# EAGLE schematic fc_shield (EAGLE 8.2.2)
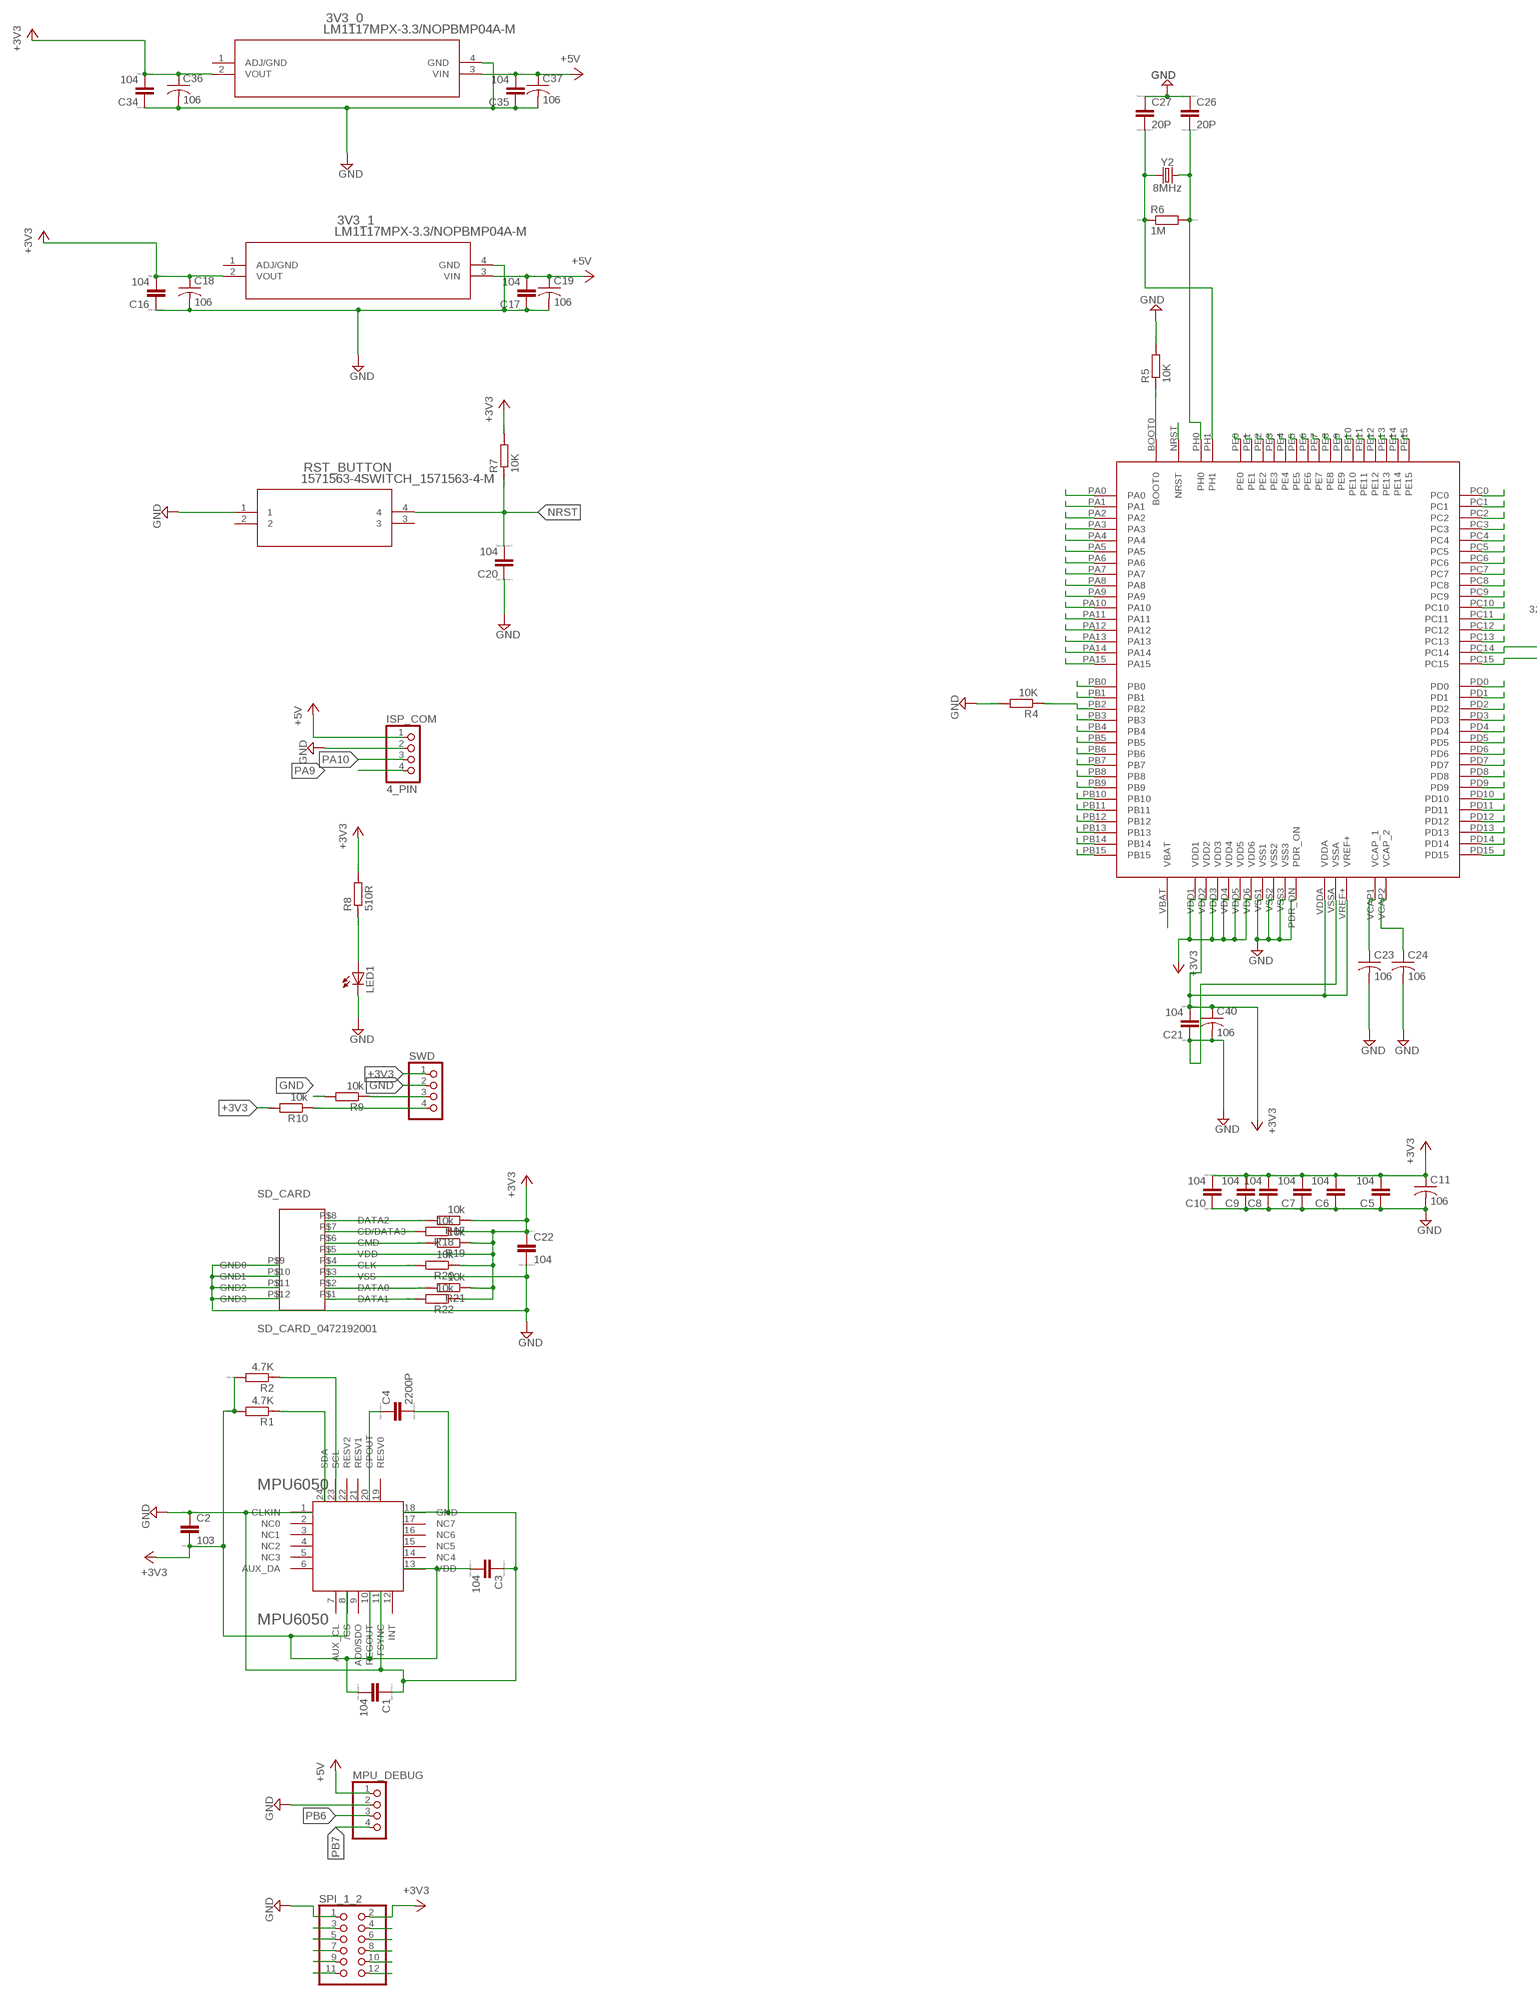
[diagram p0: schematic, sheet 1, part 1 of 2]
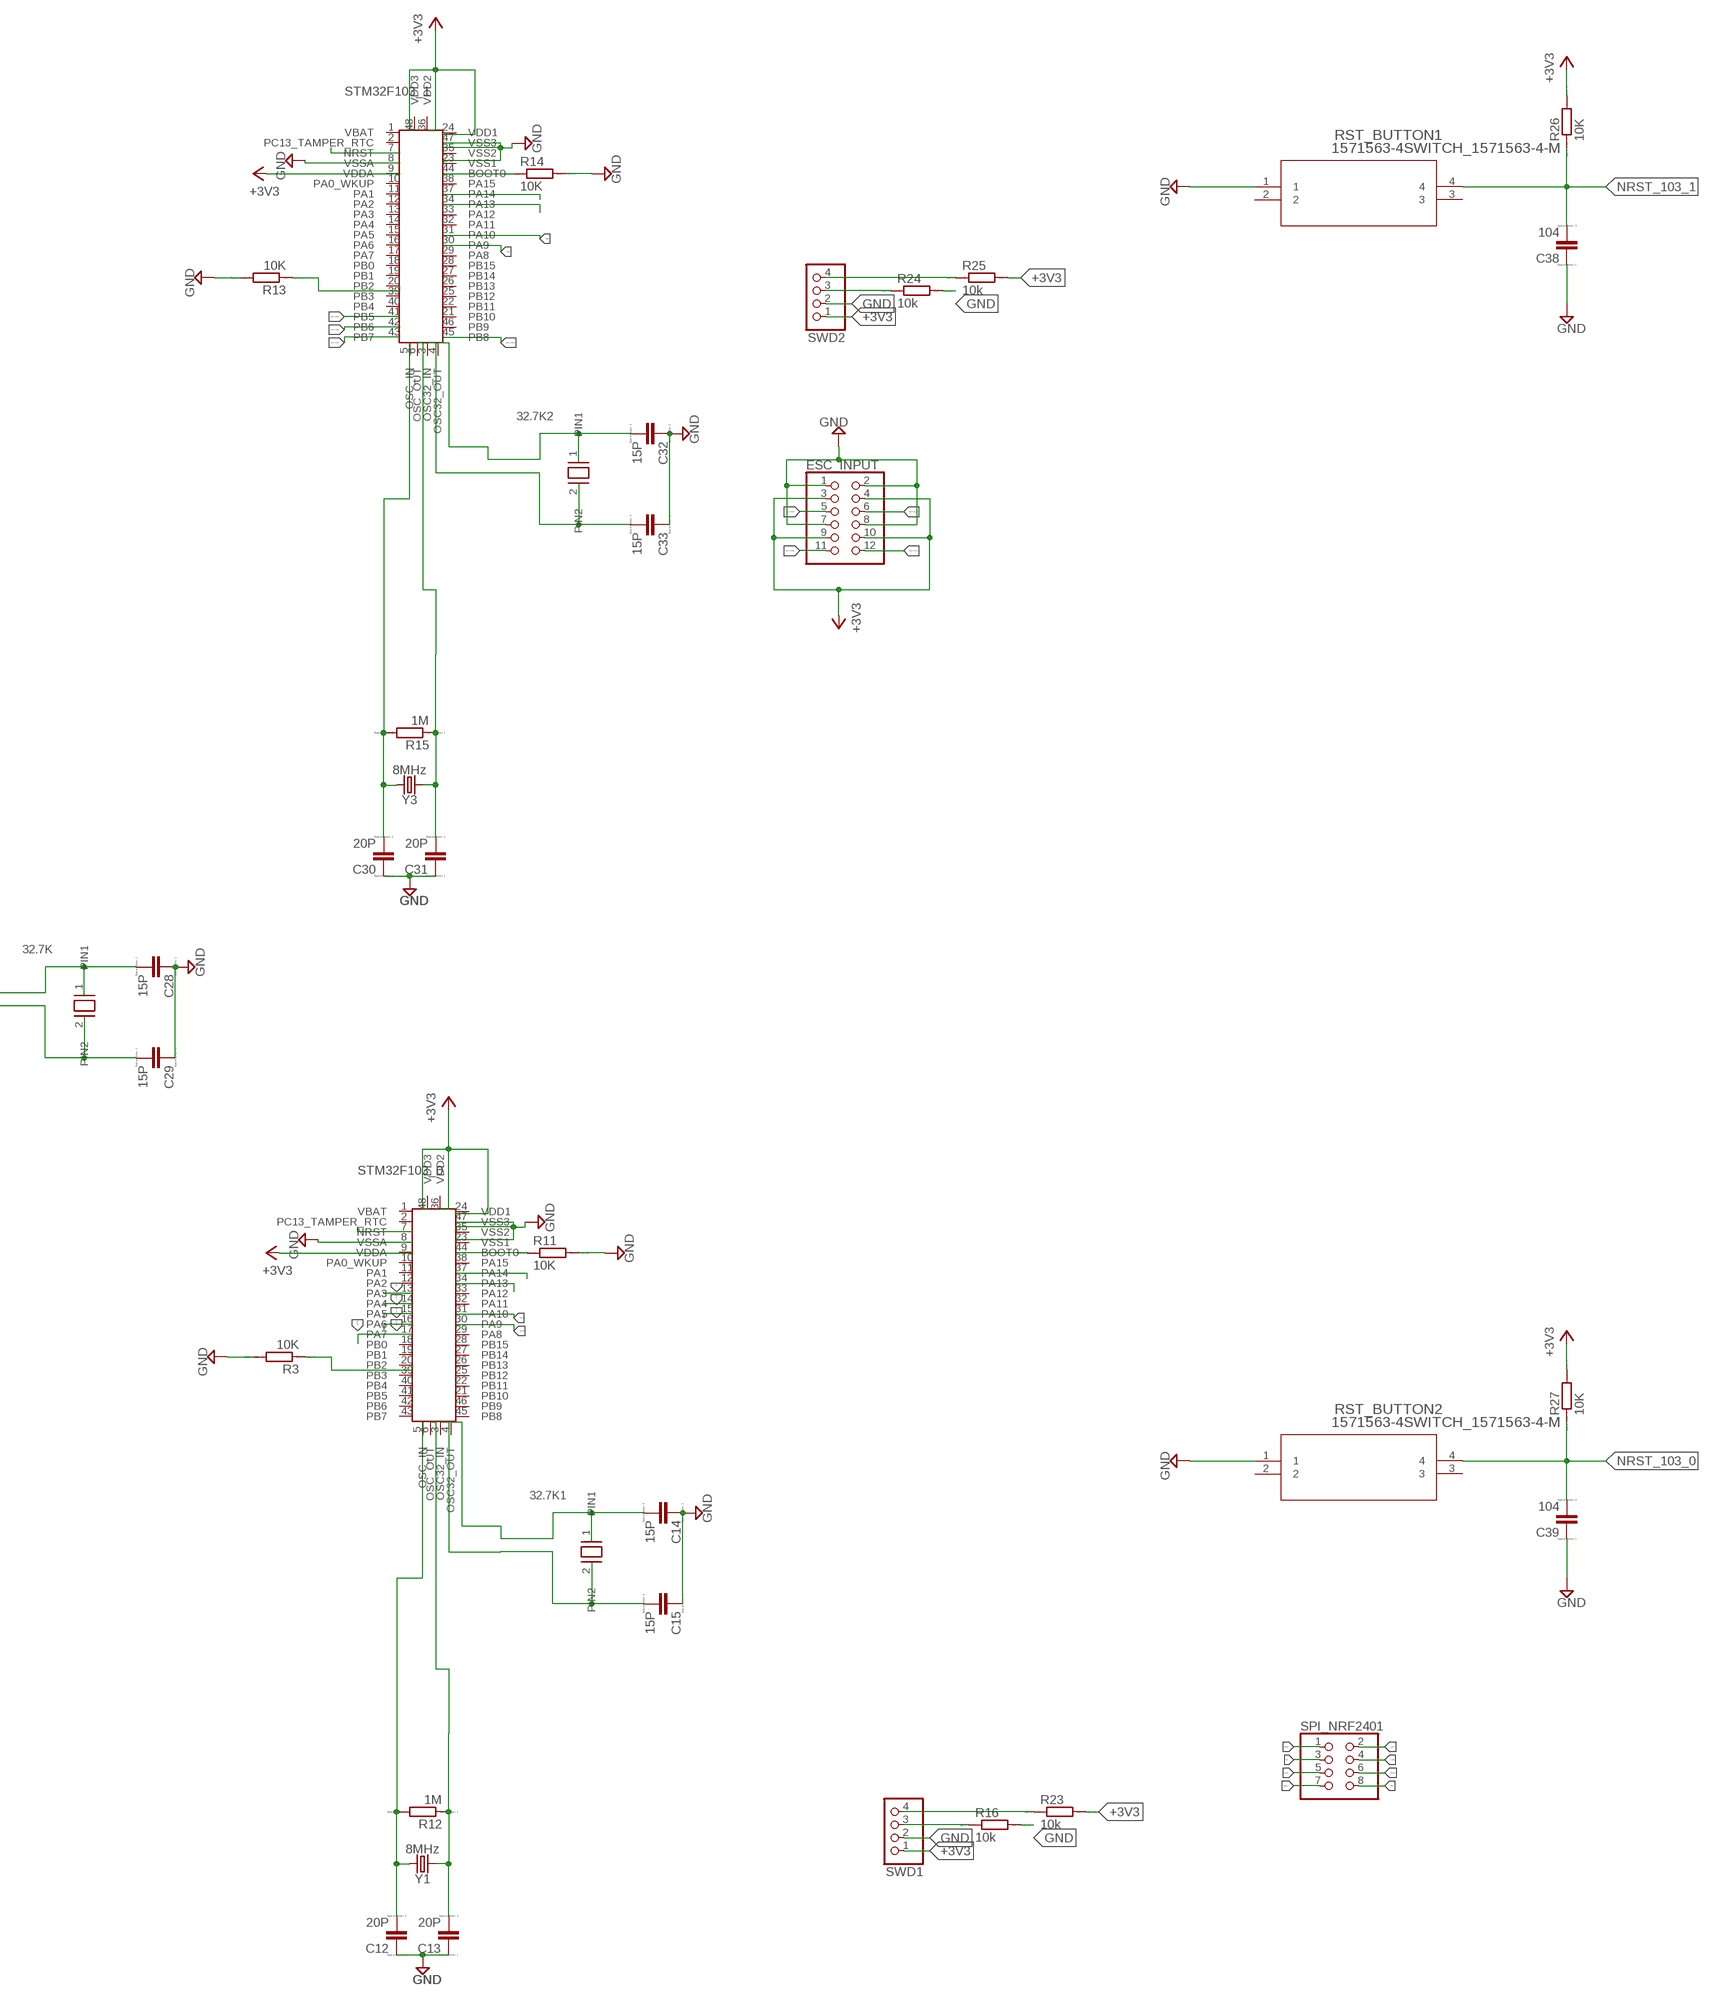
[diagram p1: schematic, sheet 1, part 2 of 2]

## Parts
3V3_0  LM1117MPX-3.3/NOPBMP04A-M  [MP04A-M]
3V3_1  LM1117MPX-3.3/NOPBMP04A-M  [MP04A-M]
32.7K  CM315D  [CM315D_32.7K]
32.7K1  CM315D  [CM315D_32.7K]
32.7K2  CM315D  [CM315D_32.7K]
C1  104  CC0603  [C0603]
C2  103  CC0603  [C0603]
C3  104  CC0603  [C0603]
C4  2200P  CC0603  [C0603]
C5  104  CC0603  [C0603]
C6  104  CC0603  [C0603]
C7  104  CC0603  [C0603]
C8  104  CC0603  [C0603]
C9  104  CC0603  [C0603]
C10  104  CC0603  [C0603]
C11  106  C-USC0805  [C0805]
C12  20P  CC0603  [C0603]
C13  20P  CC0603  [C0603]
C14  15P  CC0603  [C0603]
C15  15P  CC0603  [C0603]
C16  104  CC0603  [C0603]
C17  104  CC0603  [C0603]
C18  106  C-USC0805  [C0805]
C19  106  C-USC0805  [C0805]
C20  104  CC0603  [C0603]
C21  104  CC0603  [C0603]
C22  104  CC0603  [C0603]
C23  106  C-USC0805  [C0805]
C24  106  C-USC0805  [C0805]
C26  20P  CC0603  [C0603]
C27  20P  CC0603  [C0603]
C28  15P  CC0603  [C0603]
C29  15P  CC0603  [C0603]
C30  20P  CC0603  [C0603]
C31  20P  CC0603  [C0603]
C32  15P  CC0603  [C0603]
C33  15P  CC0603  [C0603]
C34  104  CC0603  [C0603]
C35  104  CC0603  [C0603]
C36  106  C-USC0805  [C0805]
C37  106  C-USC0805  [C0805]
C38  104  CC0603  [C0603]
C39  104  CC0603  [C0603]
C40  106  C-USC0805  [C0805]
ESC_INPUT  PINHD-2X6/90  [2X06/90]
ISP_COM  4_PIN  PINHD-1X4  [1X04]
LED1  LEDCHIPLED_0805  [CHIPLED_0805]
MPU6050  MPU6050  [MPU6050]
MPU_DEBUG  PINHD-1X4  [1X04]
R1  4.7K  RR0603  [R0603]
R2  4.7K  RR0603  [R0603]
R3  10K  RR0603  [R0603]
R4  10K  RR0603  [R0603]
R5  10K  RR0603  [R0603]
R6  1M  RR0603  [R0603]
R7  10K  RR0603  [R0603]
R8  510R  RR0603  [R0603]
R9  10k  RR0603  [R0603]
R10  10k  RR0603  [R0603]
R11  10K  RR0603  [R0603]
R12  1M  RR0603  [R0603]
R13  10K  RR0603  [R0603]
R14  10K  RR0603  [R0603]
R15  1M  RR0603  [R0603]
R16  10k  RR0603  [R0603]
R17  10k  RR0603  [R0603]
R18  10k  RR0603  [R0603]
R19  10k  RR0603  [R0603]
R20  10k  RR0603  [R0603]
R21  10k  RR0603  [R0603]
R22  10k  RR0603  [R0603]
R23  10k  RR0603  [R0603]
R24  10k  RR0603  [R0603]
R25  10k  RR0603  [R0603]
R26  10K  RR0603  [R0603]
R27  10K  RR0603  [R0603]
RST_BUTTON  1571563-4SWITCH_1571563-4-M  [SWITCH_1571563-4-M]
RST_BUTTON1  1571563-4SWITCH_1571563-4-M  [SWITCH_1571563-4-M]
RST_BUTTON2  1571563-4SWITCH_1571563-4-M  [SWITCH_1571563-4-M]
SD_CARD  SD_CARD_0472192001  [0472192001]
SPI_1_2  PINHD-2X6/90  [2X06/90]
SPI_NRF2401  PINHD-2X4  [2X04]
STM32F103_0  STM32F103C8T6  [STM32103C8T6_LQFP48]
STM32F103_1  STM32F103C8T6  [STM32103C8T6_LQFP48]
SWD  PINHD-1X4  [1X04]
SWD1  PINHD-1X4  [1X04]
SWD2  PINHD-1X4  [1X04]
U$1  STM32F4V_100PIN_GENERIC  [LQFP100]
Y1  8MHz  CRYSTAL-8MHZSMD-HC49UP  [HC49UP]
Y2  8MHz  CRYSTAL-8MHZSMD-HC49UP  [HC49UP]
Y3  8MHz  CRYSTAL-8MHZSMD-HC49UP  [HC49UP]

## Nets
+3V3: 3V3_0.2(VOUT) 3V3_1.2(VOUT) C1.2 C2.2 C3.2 C5.2 C6.2 C7.2 C8.2 C9.2 C10.2 C11.1 C16.2 C18.1 C21.2 C22.1 C34.2 C36.1 C40.1 ESC_INPUT.3 ESC_INPUT.4 ESC_INPUT.9 ESC_INPUT.10 MPU6050.8(/CS) MPU6050.10(REGOUT) MPU6050.13(VDD) R1.2 R2.2 R7.2 R8.2 R10.2 R17.1 R18.1 R19.1 R20.1 R21.1 R22.1 R23.2 R25.2 R26.2 R27.2 SD_CARD.P$5(VDD) SPI_1_2.2 SPI_NRF2401.2 STM32F103_0.9(VDDA) STM32F103_0.24(VDD1) STM32F103_0.36(VDD2) STM32F103_0.48(VDD3) STM32F103_1.9(VDDA) STM32F103_1.24(VDD1) STM32F103_1.36(VDD2) STM32F103_1.48(VDD3) SWD1.1 SWD2.1 SWD.1 U$1.VDD1 U$1.VDD2 U$1.VDD3 U$1.VDD4 U$1.VDD5 U$1.VDD6 U$1.VDDA U$1.VREF+
+5V: 3V3_0.3(VIN) 3V3_1.3(VIN) C17.2 C19.1 C35.2 C37.1 ISP_COM.1 MPU_DEBUG.1
BOOT0: R5.1 U$1.BOOT0
CE: SPI_NRF2401.3 STM32F103_0.13(PA3)
CSN: SPI_NRF2401.4 STM32F103_0.14(PA4)
GND: 3V3_0.4(GND) 3V3_1.4(GND) C1.1 C2.1 C3.1 C4.2 C5.1 C6.1 C7.1 C8.1 C9.1 C10.1 C11.2 C12.1 C13.1 C14.1 C15.1 C16.1 C17.1 C18.2 C19.2 C20.1 C21.1 C22.2 C23.2 C24.2 C26.1 C27.1 C28.1 C29.1 C30.1 C31.1 C32.1 C33.1 C34.1 C35.1 C36.2 C37.2 C38.1 C39.1 C40.2 ESC_INPUT.1 ESC_INPUT.2 ESC_INPUT.7 ESC_INPUT.8 ISP_COM.2 LED1.C MPU6050.1(CLKIN) MPU6050.11(FSYNC) MPU6050.18(GND) MPU_DEBUG.2 R3.2 R4.2 R5.2 R9.2 R11.2 R13.2 R14.2 R16.2 R24.2 RST_BUTTON1.1 RST_BUTTON2.1 RST_BUTTON.1 SD_CARD.P$3(VSS) SD_CARD.P$9(GND0) SD_CARD.P$10(GND1) SD_CARD.P$11(GND2) SD_CARD.P$12(GND3) SPI_1_2.1 SPI_NRF2401.1 STM32F103_0.8(VSSA) STM32F103_0.23(VSS1) STM32F103_0.35(VSS2) STM32F103_0.47(VSS3) STM32F103_1.8(VSSA) STM32F103_1.23(VSS1) STM32F103_1.35(VSS2) STM32F103_1.47(VSS3) SWD1.2 SWD2.2 SWD.2 U$1.PDR_ON U$1.VSS1 U$1.VSS2 U$1.VSS3 U$1.VSSA
IRQ: SPI_NRF2401.8
MISO: SPI_NRF2401.7 STM32F103_0.16(PA6)
MOSI: SPI_NRF2401.6 STM32F103_0.17(PA7)
MOTOR1: ESC_INPUT.5 STM32F103_1.41(PB5)
MOTOR2: ESC_INPUT.11 STM32F103_1.42(PB6)
MOTOR3: ESC_INPUT.6 STM32F103_1.43(PB7)
MOTOR4: ESC_INPUT.12 STM32F103_1.45(PB8)
N$1: LED1.A R8.1
N$2: R14.1 STM32F103_1.44(BOOT0)
N$3: C4.1 MPU6050.20(CPOUT)
N$4: R11.1 STM32F103_0.44(BOOT0)
N$5: R3.1 STM32F103_0.20(PB2)
N$6: R13.1 STM32F103_1.20(PB2)
NRST: C20.2 R7.1 RST_BUTTON.4 U$1.NRST
NRST_103_0: C39.2 R27.1 RST_BUTTON2.4 STM32F103_0.7(NRST)
NRST_103_1: C38.2 R26.1 RST_BUTTON1.4 STM32F103_1.7(NRST)
OSC32_IN_1: 32.7K2.2(PIN2) C33.2 STM32F103_1.3(OSC32_IN)
OSC32_IN_103: 32.7K1.2(PIN2) C15.2 STM32F103_0.3(OSC32_IN)
OSC32_OUT_1: 32.7K2.1(PIN1) C32.2 STM32F103_1.4(OSC32_OUT)
OSC32_OUT_103: 32.7K1.1(PIN1) C14.2 STM32F103_0.4(OSC32_OUT)
OSC_IN_1: C30.2 R15.2 STM32F103_1.5(OSC_IN) Y3.2
OSC_IN_103: C12.2 R12.2 STM32F103_0.5(OSC_IN) Y1.2
OSC_OUT_1: C31.2 R15.1 STM32F103_1.6(OSC_OUT) Y3.1
OSC_OUT_103: C13.2 R12.1 STM32F103_0.6(OSC_OUT) Y1.1
PA0: U$1.PA0
PA1: U$1.PA1
PA2: STM32F103_1.31(PA10) U$1.PA2
PA3: STM32F103_1.30(PA9) U$1.PA3
PA4: U$1.PA4
PA5: SPI_1_2.7 U$1.PA5
PA6: SPI_1_2.9 U$1.PA6
PA7: SPI_1_2.11 U$1.PA7
PA8: U$1.PA8
PA9: ISP_COM.4 STM32F103_0.31(PA10) U$1.PA9
PA10: ISP_COM.3 STM32F103_0.30(PA9) U$1.PA10
PA11: U$1.PA11
PA12: U$1.PA12
PA13: R10.1 SWD.4 U$1.PA13
PA14: R9.1 SWD.3 U$1.PA14
PA15: U$1.PA15
PB0: U$1.PB0
PB1: U$1.PB1
PB2: R4.1 U$1.PB2
PB3: U$1.PB3
PB4: U$1.PB4
PB5: U$1.PB5
PB6: MPU6050.23(SCL) MPU_DEBUG.3 R2.1 U$1.PB6
PB7: MPU6050.24(SDA) MPU_DEBUG.4 R1.1 U$1.PB7
PB8: U$1.PB8
PB9: U$1.PB9
PB10: SPI_1_2.8 U$1.PB10
PB11: U$1.PB11
PB12: U$1.PB12
PB13: U$1.PB13
PB14: U$1.PB14
PB15: U$1.PB15
PC0: U$1.PC0
PC1: U$1.PC1
PC2: SPI_1_2.10 U$1.PC2
PC3: SPI_1_2.12 U$1.PC3
PC4: SPI_1_2.3 U$1.PC4
PC5: SPI_1_2.5 U$1.PC5
PC6: U$1.PC6
PC7: U$1.PC7
PC8: R21.2 SD_CARD.P$2(DATA0) U$1.PC8
PC9: R22.2 SD_CARD.P$1(DATA1) U$1.PC9
PC10: R17.2 SD_CARD.P$8(DATA2) U$1.PC10
PC11: R18.2 SD_CARD.P$7(CD/DATA3) U$1.PC11
PC12: R20.2 SD_CARD.P$4(CLK) U$1.PC12
PC13: U$1.PC13
PC14: 32.7K.1(PIN1) C28.2 U$1.PC14
PC15: 32.7K.2(PIN2) C29.2 U$1.PC15
PD0: U$1.PD0
PD1: U$1.PD1
PD2: R19.2 SD_CARD.P$6(CMD) U$1.PD2
PD3: U$1.PD3
PD4: U$1.PD4
PD5: U$1.PD5
PD6: U$1.PD6
PD7: U$1.PD7
PD8: U$1.PD8
PD9: U$1.PD9
PD10: U$1.PD10
PD11: U$1.PD11
PD12: U$1.PD12
PD13: U$1.PD13
PD14: U$1.PD14
PD15: U$1.PD15
PE0: U$1.PE0
PE1: U$1.PE1
PE2: U$1.PE2
PE3: U$1.PE3
PE4: U$1.PE4
PE5: U$1.PE5
PE6: U$1.PE6
PE7: SPI_1_2.4 U$1.PE7
PE8: SPI_1_2.6 U$1.PE8
PE9: U$1.PE9
PE10: U$1.PE10
PE11: U$1.PE11
PE12: U$1.PE12
PE13: U$1.PE13
PE14: U$1.PE14
PE15: U$1.PE15
PH0: C26.2 R6.2 U$1.PH0 Y2.2
PH1: C27.2 R6.1 U$1.PH1 Y2.1
SCK: SPI_NRF2401.5 STM32F103_0.15(PA5)
SWCLK_103_0: R16.1 STM32F103_0.37(PA14) SWD1.3
SWCLK_103_1: R24.1 STM32F103_1.37(PA14) SWD2.3
SWDIO_103_0: R23.1 STM32F103_0.34(PA13) SWD1.4
SWDIO_103_1: R25.1 STM32F103_1.34(PA13) SWD2.4
VBAT: U$1.VBAT
VCAP1: C23.1 U$1.VCAP1(VCAP_1)
VCAP2: C24.1 U$1.VCAP2(VCAP_2)
Unconnected: 3V3_0.1(ADJ/GND) 3V3_1.1(ADJ/GND) MPU6050.2(NC0) MPU6050.3(NC1) MPU6050.4(NC2) MPU6050.5(NC3) MPU6050.6(AUX_DA) MPU6050.7(AUX_CL) MPU6050.9(AD0/SDO) MPU6050.12(INT) MPU6050.14(NC4) MPU6050.15(NC5) MPU6050.16(NC6) MPU6050.17(NC7) MPU6050.19(RESV0) MPU6050.21(RESV1) MPU6050.22(RESV2) RST_BUTTON1.2 RST_BUTTON1.3 RST_BUTTON2.2 RST_BUTTON2.3 RST_BUTTON.2 RST_BUTTON.3 STM32F103_0.1(VBAT) STM32F103_0.2(PC13_TAMPER_RTC) STM32F103_0.10(PA0_WKUP) STM32F103_0.11(PA1) STM32F103_0.12(PA2) STM32F103_0.18(PB0) STM32F103_0.19(PB1) STM32F103_0.21(PB10) STM32F103_0.22(PB11) STM32F103_0.25(PB12) STM32F103_0.26(PB13) STM32F103_0.27(PB14) STM32F103_0.28(PB15) STM32F103_0.29(PA8) STM32F103_0.32(PA11) STM32F103_0.33(PA12) STM32F103_0.38(PA15) STM32F103_0.39(PB3) STM32F103_0.40(PB4) STM32F103_0.41(PB5) STM32F103_0.42(PB6) STM32F103_0.43(PB7) STM32F103_0.45(PB8) STM32F103_0.46(PB9) STM32F103_1.1(VBAT) STM32F103_1.2(PC13_TAMPER_RTC) STM32F103_1.10(PA0_WKUP) STM32F103_1.11(PA1) STM32F103_1.12(PA2) STM32F103_1.13(PA3) STM32F103_1.14(PA4) STM32F103_1.15(PA5) STM32F103_1.16(PA6) STM32F103_1.17(PA7) STM32F103_1.18(PB0) STM32F103_1.19(PB1) STM32F103_1.21(PB10) STM32F103_1.22(PB11) STM32F103_1.25(PB12) STM32F103_1.26(PB13) STM32F103_1.27(PB14) STM32F103_1.28(PB15) STM32F103_1.29(PA8) STM32F103_1.32(PA11) STM32F103_1.33(PA12) STM32F103_1.38(PA15) STM32F103_1.39(PB3) STM32F103_1.40(PB4) STM32F103_1.46(PB9)

## Library data of the parts
3V3_0 3V3_1 = lm1117:LM1117MPX-3.3/NOPB; MANUFACTURER_PART_NUMBER: LM1117MPX3.3NOPB; VENDOR: National Semiconductor
32.7K 32.7K1 32.7K2 = CM315D_PAC:CM315D
C1-C10 C12-C17 C20-C22 C26-C35 C38 C39 = eagle-ltspice:C: CAPACITOR, European symbol; SPICEMODEL: NONE; SPICEPREFIX: C
C11 C18 C19 C23 C24 C36 C37 C40 = rcl:C-US: CAPACITOR, American symbol
ESC_INPUT SPI_1_2 = pinhead:PINHD-2X6: PIN HEADER
ISP_COM MPU_DEBUG SWD SWD1 SWD2 = pinhead:PINHD-1X4: PIN HEADER
LED1 = led:LED: LED OSRAM: - CHIPLED LG R971, LG N971, LY N971, LG Q971, LY Q971, LO R971, LY R971 LH N974, LH R974 LS Q976, LO Q976, LY Q976 LO Q996 - Hyper CHIPLED LW Q18S LB Q993, LB Q99A, LB R99A - SideLED LS A670, LO A670, LY A670, LG A670, LP A670 LB A673, LV A673, LT A673, LW A673 LH A674 LY A675 LS A676, LA A676, LO A676, LY A676, LW A676 LS A679, LY A679, LG A679 - Hyper Micro SIDELED® LS Y876, LA Y876, LO Y876, LY Y876 LT Y87S - SmartLED LW L88C, LW L88S LB L89C, LB L89S, LG L890 LS L89K, LO L89K, LY L89K LS L896, LA L896, LO L896, LY L896 - TOPLED LS T670, LO T670, LY T670, LG T670, LP T670 LSG T670, LSP T670, LSY T670, LOP T670, LYG T670 LG T671, LOG T671, LSG T671 LB T673, LV T673, LT T673, LW T673 LH T674 LS T676, LA T676, LO T676, LY T676, LB T676, LH T676, LSB T676, LW T676 LB T67C, LV T67C, LT T67C, LS T67K, LO T67K, LY T67K, LW E67C LS E67B, LA E67B, LO E67B, LY E67B, LB E67C, LV E67C, LT E67C LW T67C LS T679, LY T679, LG T679 LS T770, LO T770, LY T770, LG T770, LP T770 LB T773, LV T773, LT T773, LW T773 LH T774 LS E675, LA E675, LY E675, LS T675 LS T776, LA T776, LO T776, LY T776, LB T776 LHGB T686 LT T68C, LB T68C - Hyper Mini TOPLED® LB M676 - Mini TOPLED Santana® LG M470 LS M47K, LO M47K, LY M47K Source: http://www.osram.convergy.de LUXEON: - LUMILED® LXK2-PW12-R00, LXK2-PW12-S00, LXK2-PW14-U00, LXK2-PW14-V00 LXK2-PM12-R00, LXK2-PM12-S00, LXK2-PM14-U00 LXK2-PE12-Q00, LXK2-PE12-R00, LXK2-PE12-S00, LXK2-PE14-T00, LXK2-PE14-U00 LXK2-PB12-K00, LXK2-PB12-L00, LXK2-PB12-M00, LXK2-PB14-N00, LXK2-PB14-P00, LXK2-PB14-Q00 LXK2-PR12-L00, LXK2-PR12-M00, LXK2-PR14-Q00, LXK2-PR14-R00 LXK2-PD12-Q00, LXK2-PD12-R00, LXK2-PD12-S00 LXK2-PH12-R00, LXK2-PH12-S00 LXK2-PL12-P00, LXK2-PL12-Q00, LXK2-PL12-R00 Source: www.luxeon.com KINGBRIGHT: KA-3528ASYC Source: www.kingbright.com
MPU6050 = mpu6050_pac:MPU6050
R1-R27 = eagle-ltspice:R: RESISTOR, European symbol; SPICEMODEL: NONE; SPICEPREFIX: R
RST_BUTTON RST_BUTTON1 RST_BUTTON2 = pushbutton_sw_surface_mt:1571563-4; MANUFACTURER_PART_NUMBER: 15715634; VENDOR: Tyco Electronics
SD_CARD = 0472192001_LEADFREE:SD_CARD_0472192001
SPI_NRF2401 = pinhead:PINHD-2X4: PIN HEADER
STM32F103_0 STM32F103_1 = STM32103C8T6:STM32F103C8T6
U$1 = stm32f4:STM32F4V_100PIN_GENERIC
Y1-Y3 = SparkFun-Clocks:CRYSTAL-8MHZ: 8MHz Crystal Datasheet Example <http://www.futureelectronics.com/en/technologies/electromechanical/timing-devices/crystals/Pages/6008189-ABM3B-8.000MHZ-B2-T.aspx?IM=0> Frequency: 8MHz Frequency Tolerance: ±20ppm Load Capacitance: 18pF SparkFun Products: Pro Micro -3.3V/8MHz <https://www.sparkfun.com/products/12587> WAV Trigger <https://www.sparkfun.com/products/13660>; PROD_ID: XTAL-11706